# Altium schematic sheet SH1 - Power.SchDoc
size OrCAD A
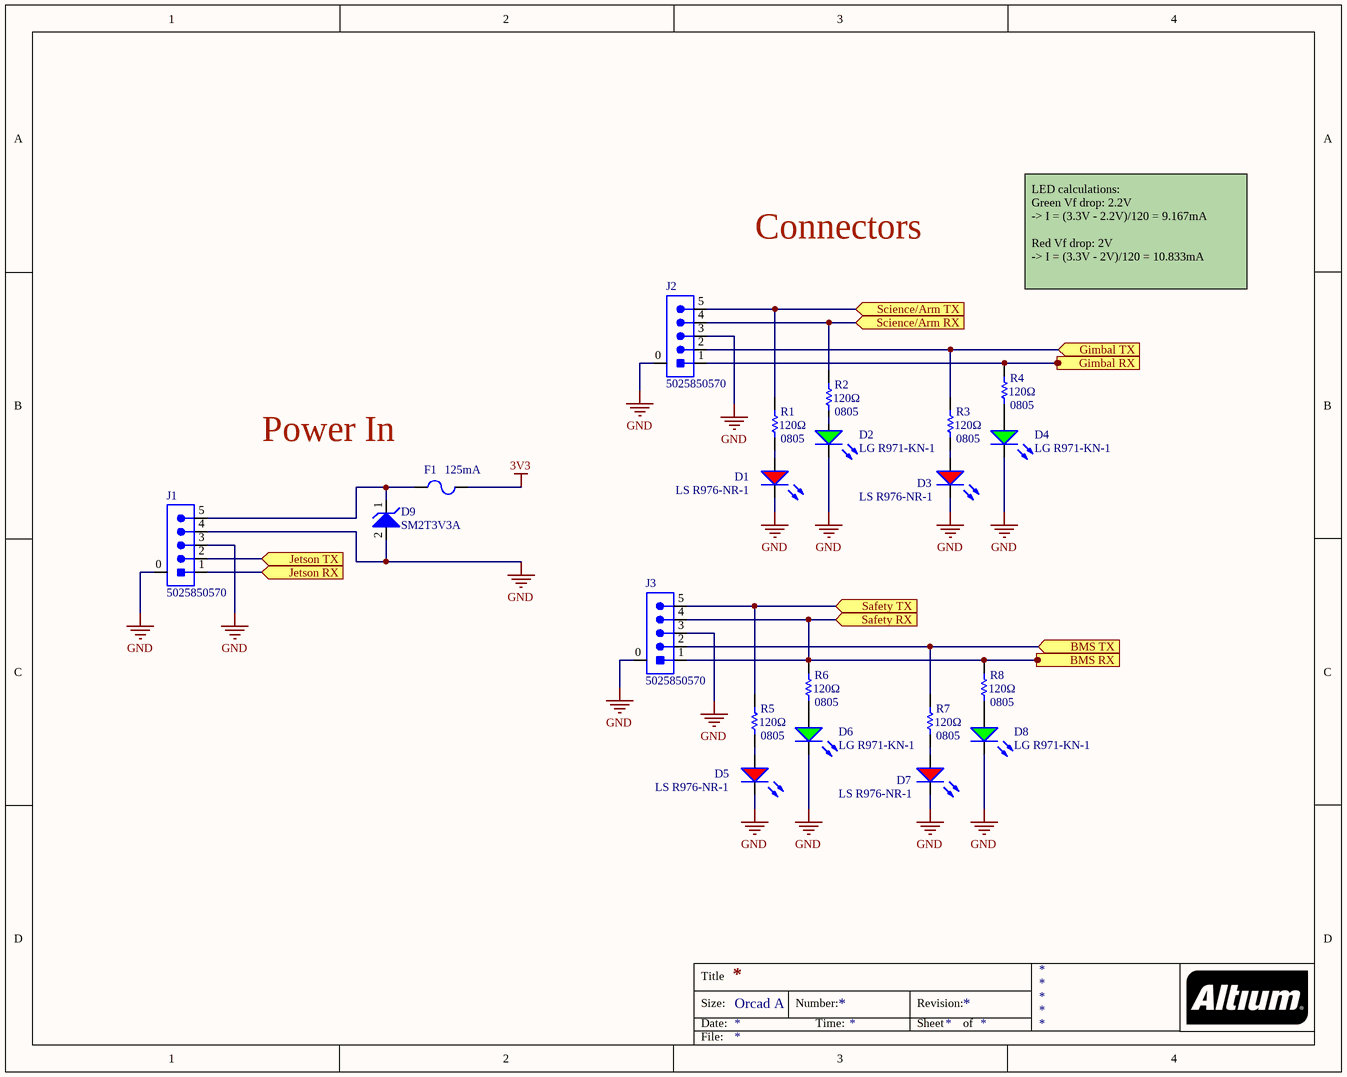
[diagram p0: SH1 - Power.SchDoc]

## Parts
D1  LS R976-NR-1  [LED_0805_LINE]
D2  LG R971-KN-1  [LED_0805_LINE]
D3  LS R976-NR-1  [LED_0805_LINE]
D4  LG R971-KN-1  [LED_0805_LINE]
D5  LS R976-NR-1  [LED_0805_LINE]
D6  LG R971-KN-1  [LED_0805_LINE]
D7  LS R976-NR-1  [LED_0805_LINE]
D8  LG R971-KN-1  [LED_0805_LINE]
D9  Manufacturer Part Number: SM2T3V3A  [TVS_DIODE_UNIDIR]  (hidden comment: TVS_DIODE_UNIDIR_3.3V)
F1  Current Rating: 125mA  [FUSE_1206]  (hidden comment: FUSE_125mA_1206)
J1  Manufacturer Part Number 1: 5025850570  [MOLEX-5025850570]  (hidden comment: CON_5M_SM_RA)
J2  Manufacturer Part Number 1: 5025850570  [MOLEX-5025850570]  (hidden comment: CON_5M_SM_RA)
J3  Manufacturer Part Number 1: 5025850570  [MOLEX-5025850570]  (hidden comment: CON_5M_SM_RA)
R1  Case Code (Imperial): 0805  Resistance: 120Ω  [RESC2012X60N]  (hidden comment: 120)
R2  Case Code (Imperial): 0805  Resistance: 120Ω  [RESC2012X60N]  (hidden comment: 120)
R3  Case Code (Imperial): 0805  Resistance: 120Ω  [RESC2012X60N]  (hidden comment: 120)
R4  Case Code (Imperial): 0805  Resistance: 120Ω  [RESC2012X60N]  (hidden comment: 120)
R5  Case Code (Imperial): 0805  Resistance: 120Ω  [RESC2012X60N]  (hidden comment: 120)
R6  Case Code (Imperial): 0805  Resistance: 120Ω  [RESC2012X60N]  (hidden comment: 120)
R7  Case Code (Imperial): 0805  Resistance: 120Ω  [RESC2012X60N]  (hidden comment: 120)
R8  Case Code (Imperial): 0805  Resistance: 120Ω  [RESC2012X60N]  (hidden comment: 120)

## Ports
BMS RX (in), BMS TX (in), Gimbal RX (in), Gimbal TX (in), Jetson RX (in), Jetson TX (in), Safety RX (in), Safety TX (in), Science/Arm RX (in), Science/Arm TX (in)

## Nets
3V3: F1.2
GND: D1.2(K) D2.2(K) D3.2(K) D4.2(K) D5.2(K) D6.2(K) D7.2(K) D8.2(K) D9.2 J1.0 J1.3 J1.4 J2.0 J2.3 J3.0 J3.3
BMS RX: J3.1 J3.4 R6.1 R8.1 ; port Safety RX, port BMS RX
BMS TX: J3.2 R7.1 ; port BMS TX
Gimbal RX: J2.1 R4.1 ; port Gimbal RX
Gimbal TX: J2.2 R3.1 ; port Gimbal TX
Jetson RX: J1.1 ; port Jetson RX
Jetson TX: J1.2 ; port Jetson TX
Safety TX: J3.5 R5.1 ; port Safety TX
Science/Arm RX: J2.4 R2.1 ; port Science/Arm RX
Science/Arm TX: J2.5 R1.1 ; port Science/Arm TX
NetD1_1: D1.1(A) R1.2
NetD2_1: D2.1(A) R2.2
NetD3_1: D3.1(A) R3.2
NetD4_1: D4.1(A) R4.2
NetD5_1: D5.1(A) R5.2
NetD6_1: D6.1(A) R6.2
NetD7_1: D7.1(A) R7.2
NetD8_1: D8.1(A) R8.2
NetD9_1: D9.1 F1.1 J1.5

## Notes on the sheet
- Connectors
- LED calculations:
  Green Vf drop: 2.2V
  -> I = (3.3V - 2.2V)/120 = 9.167mA
  Red Vf drop: 2V
  -> I = (3.3V - 2V)/120 = 10.833mA
- Power In
- Title
- Size:
- Date:
- Orcad A
- Number:
- Time:
- Revision:
- Sheet
- of
- File:

## Library data of the parts
D1 D3 D5 D7 = DIO_LED_R: LED RED DIFFUSED 0805 SMD; Manufacturer 1: OSRAM; Forward Voltage Drop: 2V; Package: 0805 (2012 Metric); Supplier Part Number 1: 475-1278-1-ND; Supplier 1: Digi-Key; Mount: Surface Mount; Manufacturer Part Number 1: LS R976-NR-1
D2 D4 D6 D8 = DIO_LED_G: LED GREEN DIFFUSED 0805 SMD; Manufacturer 1: OSRAM; Forward Voltage Drop: 2.2V; Package: 0805 (2012 Metric); Supplier Part Number 1: 475-1410-1-ND; Supplier 1: Digi-Key; Mount: Surface Mount; Manufacturer Part Number 1: LG R971-KN-1
D9 = TVS_DIODE_UNIDIR_3.3V: TVS DIODE 3.3V 6.8V DO216AA; Manufacturer: STMicroelectronics; Direction: Unidirectional; Peak Pulse Power: 200W; Min Breakdown Voltage: 3.6V; Peak Pulse Current: 30A; Power Line Protection: No; Test Current: 1mA; Max Reverse Leakage Current: 500uA; Max Power Dissipation: 2.5W; Number of Channels: 1; Element Configuration: Single; ESD Protection: Yes; Supplier 1: Digi-Key; RoHS: Yes; Category: TVS Diodes; Stock 1: 22979; Pricing 1: 1=0.39000, 10=0.33800, 25=0.31520, 100=0.23400, 500=0.18270, 1000=0.14850, 2500=0.13950, 5000=0.12600 (USD); Mount: Surface Mount; Number of Pins: 2; Contact Plating: Tin,Matte; Min Operating Temperature: -65°C; Max Operating Temperature: 150°C; Reverse Standoff Voltage: 3.3V; Packaging: Tape and Reel; Clamping Voltage: 6.8V; Polarity: Unidirectional; Composition: Zener; Package Quantity: 1; Reverse Breakdown Voltage: 3.6V; Breakdown Voltage: 3.6V; Termination: SMD/SMT; Number of Unidirectional Channels: 1; Number of Elements: 1; Max Breakdown Voltage: 3.6V; Leakage Current: 500uA; Operating Supply Voltage: 3.3V; Max Surge Current: 30A; Power Dissipation: 2.5W; Length: 2.05mm; Height: 1.15mm; Width: 2.05mm; Radiation Hardening: No; Lead Free: Lead Free; REACH SVHC: No SVHC; ComponentLink1URL: https://datasheet.ciiva.com:443/pdfs/VipMasterIC/IC/SGST/SGST-S-A0001375484/SGST-S-A0001375484-1.pdf?src-supplier=IHS+Markit; ComponentLink1Description: https://datasheet.ciiva.com:443/pdfs/VipMasterIC/IC/SGST/SGST-S-A0001375484/SGST-S-A0001375484-1.pdf?src-supplier=IHS+Markit; ComponentLink2URL: https://datasheet.ciiva.com/4510/cd00070945-4510608.pdf?src-supplier=Mouser; ComponentLink2Description: https://datasheet.ciiva.com/4510/cd00070945-4510608.pdf?src-supplier=Mouser; ComponentLink3URL: https://datasheet.ciiva.com/15143/getdatasheetpartid-143099-15143712.pdf?src-supplier=Verical; ComponentLink3Description: https://datasheet.ciiva.com/15143/getdatasheetpartid-143099-15143712.pdf?src-supplier=Verical; ComponentLink4URL: https://datasheet.ciiva.com/5783/1312058-5783003.pdf?src-supplier=Farnell; ComponentLink4Description: https://datasheet.ciiva.com/5783/1312058-5783003.pdf?src-supplier=Farnell; ComponentLink5URL: https://datasheet.ciiva.com/338/cd00070945-338292.pdf?src-supplier=Digi-Key; ComponentLink5Description: https://datasheet.ciiva.com/338/cd00070945-338292.pdf?src-supplier=Digi-Key; ComponentLink6URL: https://datasheet.ciiva.com/338/cd00070945-338293.pdf?src-supplier=Digi-Key; ComponentLink6Description: https://datasheet.ciiva.com/338/cd00070945-338293.pdf?src-supplier=Digi-Key; ComponentLink7URL: https://datasheet.ciiva.com/338/cd00070945-338294.pdf?src-supplier=Digi-Key; ComponentLink7Description: https://datasheet.ciiva.com/338/cd00070945-338294.pdf?src-supplier=Digi-Key; ComponentLink8URL: https://datasheet.ciiva.com/22695/1794551-22695687.pdf?src-supplier=Element14; ComponentLink8Description: https://datasheet.ciiva.com/22695/1794551-22695687.pdf?src-supplier=Element14; ComponentLink9URL: https://datasheet.ciiva.com/7973/1794551-7973387.pdf?src-supplier=Element14; ComponentLink9Description: https://datasheet.ciiva.com/7973/1794551-7973387.pdf?src-supplier=Element14; ComponentLink10URL: https://datasheet.ciiva.com/41443/001184275-da-01-en-transil-low-volt-u-sm2t3v3a-do-216aa-stm-41443543.pdf?src-supplier=Conrad; ComponentLink10Description: https://datasheet.ciiva.com/41443/001184275-da-01-en-transil-low-volt-u-sm2t3v3a-do-216aa-stm-41443543.pdf?src-supplier=Conrad; Supplier Part Number 1: 497-7878-1-ND
F1 = FUSE_125mA_1206: FUSE SMD 125mA 125V; Manufacturer 1: Littelfuse; Manufacturer Part Number 1: 0466.125NRHF; DC Cold Resistance: 4R; Fuse Type: Board Mount (Cartridge Style Excluded); Power Dissipation: 69.1mW; Approvals: UL,CSA; Supplier 1: Digi-Key; Mount: Surface Mount; Case/Package: 1206; Case Code (Metric): 3216; Case Code (Imperial): 1206; Housing Material: Ceramic; Min Operating Temperature: -55°C; Max Operating Temperature: 90°C; Voltage Rating (AC): 125V; Voltage Rating (DC): 125V; Working Voltage: 125V; Length: 3.18mm; Height: 0.023inch; Depth: 1.52mm; Width: 0.06inch; Supplier Part Number 1: F6016CT-ND
J1-J3 = CON_5M_SM_RA: CONN HEADER SMD RIGHT ANGLE 1.5MM PITCH; Manufacturer 1: Molex; Connector Type: Receptacle,Center Strip Contact; Number of Positions: 5; Current Rating: 2A; Supplier 1: Digi-Key; Mount: Surface Mount; Termination: Solder; Number of Contacts: 5; Orientation: Right Angle; Number of Circuits: 5; Number of Rows: 1; Supplier Part Number 1: WM14469CT-ND
R1-R8 = RES_120Ω_0805: RES SMD 120 OHM 1% 1/8W 0805; Manufacturer 1: Vishay; Manufacturer Part Number 1: CRCW0805120RFKEA; Power Rating: 125mW; Voltage Rating: 150V; ComponentLink7URL: https://datasheet.ciiva.com/2467/dcrcwe3-2467513.pdf?src-supplier=Digi-Key; ComponentLink7Description: https://datasheet.ciiva.com/2467/dcrcwe3-2467513.pdf?src-supplier=Digi-Key; ComponentLink8URL: https://datasheet.ciiva.com/16852/dcrcwe3-16852841.pdf?src-supplier=Avnet+Europe; ComponentLink8Description: https://datasheet.ciiva.com/16852/dcrcwe3-16852841.pdf?src-supplier=Avnet+Europe; ComponentLink9URL: https://datasheet.ciiva.com/7777/1697337-7777354.pdf?src-supplier=Element14; ComponentLink9Description: https://datasheet.ciiva.com/7777/1697337-7777354.pdf?src-supplier=Element14; ComponentLink10URL: https://datasheet.ciiva.com/16788/70201119-16788154.pdf?src-supplier=Allied+Electronics; ComponentLink10Description: https://datasheet.ciiva.com/16788/70201119-16788154.pdf?src-supplier=Allied+Electronics; ComponentLink11URL: https://datasheet.ciiva.com/7777/1720486-7777567.pdf?src-supplier=Element14; ComponentLink11Description: https://datasheet.ciiva.com/7777/1720486-7777567.pdf?src-supplier=Element14; Supplier 1: Digi-Key; Mount: Surface Mount; Case Code (Metric): 2012; Supplier Part Number 1: 541-120CCT-ND; Package: 0805 (2012 Metric)